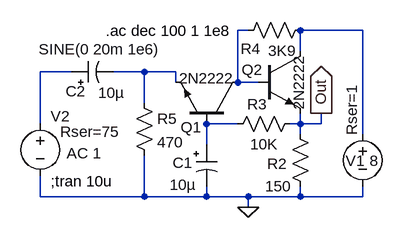
[diagram p0: schematic VidAmp.asc]
VidAmp.asc, the LTspice schematic file:
Version 4
SHEET 1 880 680
WIRE -208 240 -208 160
WIRE -208 352 -208 320
WIRE -160 160 -208 160
WIRE -48 160 -96 160
WIRE -48 208 -48 160
WIRE -48 352 -208 352
WIRE -48 352 -48 288
WIRE 0 160 -48 160
WIRE 0 176 0 160
WIRE 48 272 48 240
WIRE 48 352 -48 352
WIRE 48 352 48 336
WIRE 96 176 96 96
WIRE 96 240 48 240
WIRE 112 96 96 96
WIRE 112 352 48 352
WIRE 112 368 112 352
WIRE 128 176 96 176
WIRE 192 128 192 96
WIRE 192 240 176 240
WIRE 192 240 192 224
WIRE 192 256 192 240
WIRE 192 352 112 352
WIRE 192 352 192 336
WIRE 224 240 192 240
WIRE 224 240 224 224
WIRE 288 96 192 96
WIRE 288 256 288 96
WIRE 288 352 192 352
WIRE 288 352 288 336
FLAG 112 368 0
FLAG 224 224 Out
IOPIN 224 224 Out
SYMBOL npn2 96 240 M270
WINDOW 0 -5 88 VLeft 0
WINDOW 3 70 90 VLeft 0
SYMATTR InstName Q1
SYMATTR Value 2N2222
SYMBOL npn2 128 128 R0
WINDOW 0 -26 29 Left 0
WINDOW 3 62 6 VRight 0
SYMATTR InstName Q2
SYMATTR Value 2N2222
SYMBOL res 176 240 R0
WINDOW 0 -35 61 Left 0
WINDOW 3 -38 96 Left 0
SYMATTR InstName R2
SYMATTR Value 150
SYMATTR SpiceLine tol=1 pwr=0.1
SYMBOL res 192 224 R90
WINDOW 0 1 66 VBottom 0
WINDOW 3 32 56 VTop 0
SYMATTR InstName R3
SYMATTR Value 10K
SYMATTR SpiceLine tol=1 pwr=0.1
SYMBOL polcap 32 272 R0
WINDOW 0 -36 28 Left 0
WINDOW 3 -41 62 Left 0
SYMATTR InstName C1
SYMATTR Value 10µ
SYMATTR Description Capacitor
SYMATTR Type cap
SYMATTR SpiceLine V=16 Irms=35m Rser=2.8 MTBF=1000 Lser=0 mfg="Nichicon" pn="UPR1C100MAH" type="Al electrolytic" ppPkg=1
SYMBOL voltage 288 240 R0
WINDOW 123 0 0 Left 0
WINDOW 39 -17 -61 VRight 0
WINDOW 0 -26 57 Left 0
WINDOW 3 11 57 Left 0
SYMATTR SpiceLine Rser=1
SYMATTR InstName V1
SYMATTR Value 8
SYMBOL polcap -160 176 R270
WINDOW 0 -14 -9 VRight 0
WINDOW 3 -16 41 VRight 0
SYMATTR InstName C2
SYMATTR Value 10µ
SYMATTR Description Capacitor
SYMATTR Type cap
SYMATTR SpiceLine V=16 Irms=35m Rser=2.8 MTBF=1000 Lser=0 mfg="Nichicon" pn="UPR1C100MAH" type="Al electrolytic" ppPkg=1
SYMBOL voltage -208 224 R0
WINDOW 0 16 4 Left 0
WINDOW 3 184 -99 Right 0
WINDOW 123 41 61 Left 0
WINDOW 39 31 28 Left 0
SYMATTR InstName V2
SYMATTR Value SINE(0 20m 1e6)
SYMATTR Value2 AC 1
SYMATTR SpiceLine Rser=75
SYMBOL res 208 80 R90
WINDOW 0 60 92 VBottom 0
WINDOW 3 32 44 VTop 0
SYMATTR InstName R4
SYMATTR Value 3K9
SYMATTR SpiceLine tol=1 pwr=0.1
SYMBOL res -64 192 R0
SYMATTR InstName R5
SYMATTR Value 470
SYMATTR SpiceLine tol=1 pwr=0.1
TEXT -107 97 Left 0 !.ac dec 100 1 1e8
TEXT -192 328 Left 0 !;tran 10u

The netlist it stands for:
* VidAmp.asc
Q1 N004 N003 N002 0 2N2222
Q2 N005 N004 Out 0 2N2222
R2 Out 0 150 tol=1 pwr=0.1
R3 Out N003 10K tol=1 pwr=0.1
C1 N003 0 10µ V=16 Irms=35m Rser=2.8 MTBF=1000 Lser=0 mfg="Nichicon" pn="UPR1C100MAH" type="Al electrolytic" ppPkg=1
V1 N005 0 8 Rser=1
C2 N001 N002 10µ V=16 Irms=35m Rser=2.8 MTBF=1000 Lser=0 mfg="Nichicon" pn="UPR1C100MAH" type="Al electrolytic" ppPkg=1
V2 N001 0 SINE(0 20m 1e6) AC 1 Rser=75
R4 N005 N004 3K9 tol=1 pwr=0.1
R5 N002 0 470 tol=1 pwr=0.1
.model NPN NPN
.model PNP PNP
.lib standard.bjt
.ac dec 100 1 1e8
;tran 10u
.backanno
.end